# Altium schematic sheet Top.SchDoc: GPS - LTE Asset Tracker
size A4; Engineer: Mark Harris
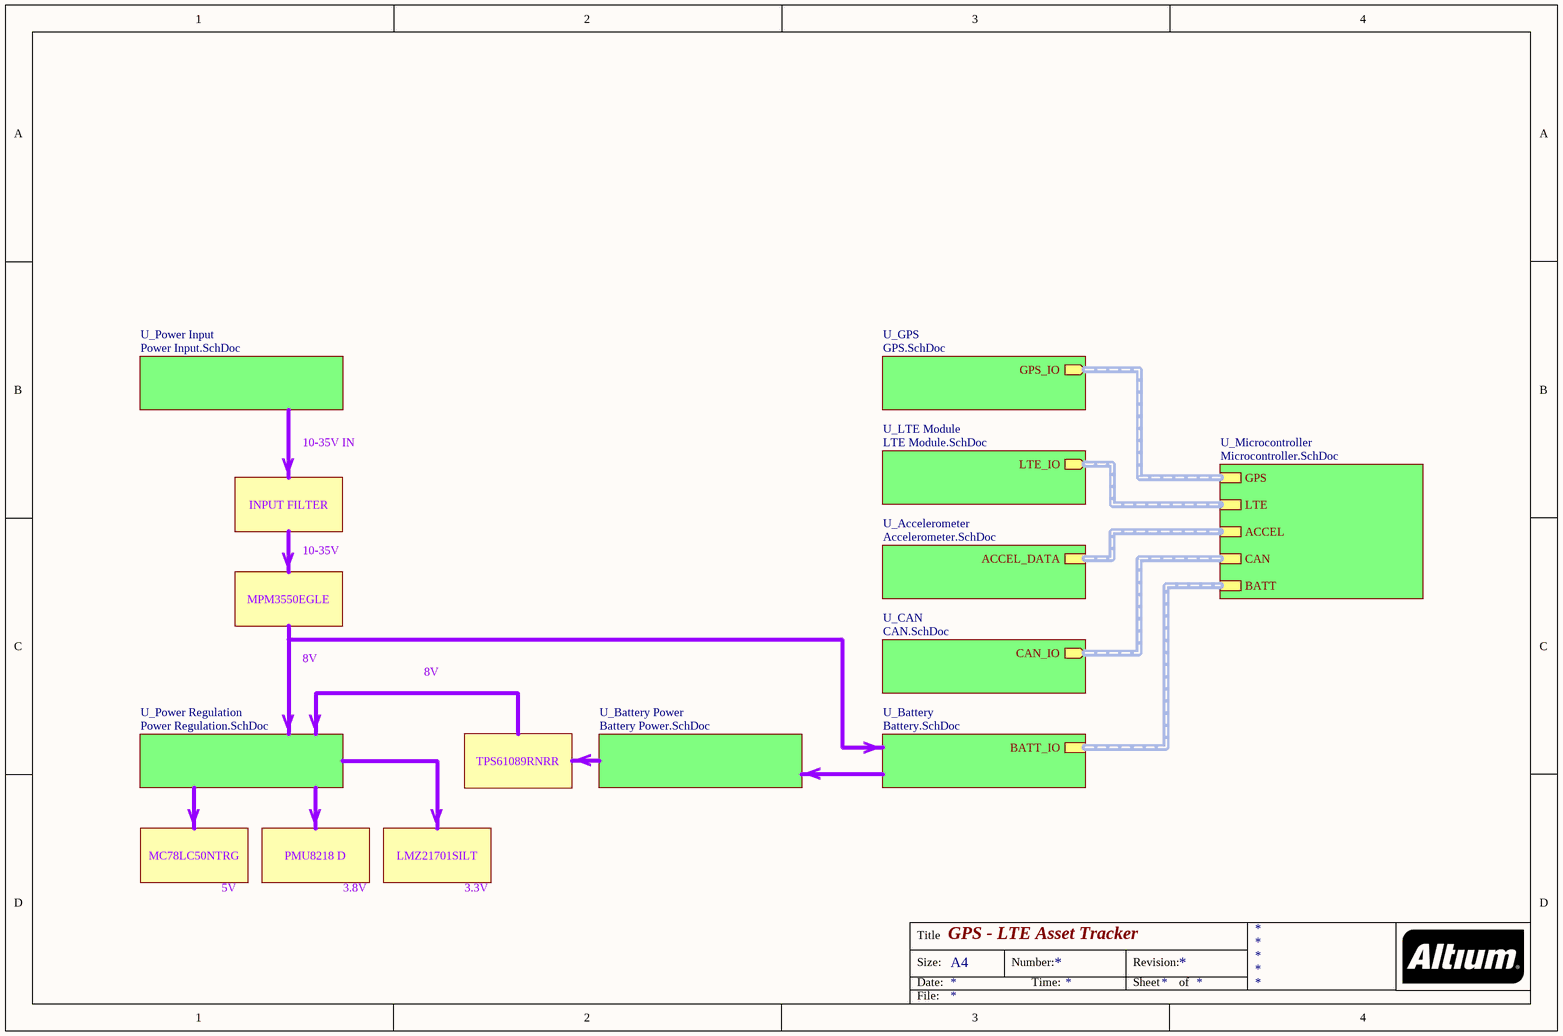
[diagram p0: Top.SchDoc]

## Sub-sheets
U_Accelerometer = Accelerometer.SchDoc: ACCEL_DATA (harness ACCEL)
U_Battery = Battery.SchDoc: BATT_IO (harness BATT)
U_Battery Power = Battery Power.SchDoc: no entries
U_CAN = CAN.SchDoc: CAN_IO (out, harness CAN)
U_GPS = GPS.SchDoc: GPS_IO (out, harness GPS)
U_LTE Module = LTE Module.SchDoc: LTE_IO (out, harness LTE)
U_Microcontroller = Microcontroller.SchDoc: ACCEL (harness ACCEL), CAN (harness CAN), GPS (harness GPS), LTE (harness LTE), BATT (harness BATT)
U_Power Input = Power Input.SchDoc: no entries
U_Power Regulation = Power Regulation.SchDoc: no entries

## Buses and harness runs
harness sheet U_Accelerometer/ACCEL_DATA = sheet U_Microcontroller/ACCEL
harness sheet U_Battery/BATT_IO = sheet U_Microcontroller/BATT
harness sheet U_CAN/CAN_IO = sheet U_Microcontroller/CAN
harness sheet U_GPS/GPS_IO = sheet U_Microcontroller/GPS
harness sheet U_LTE Module/LTE_IO = sheet U_Microcontroller/LTE

## Notes on the sheet
- 10-35V IN
- INPUT FILTER
- V
- 10-35V
- MPM3550EGLE
- 8V
- TPS61089RNRR
- MC78LC50NTRG
- PMU8218 D
- LMZ21701SILT
- 5V
- 3.8V
- 3.3V
- Title
- Size:
- Date:
- A4
- Number:
- Time:
- Revision:
- Sheet
- of
- File: